# Altium schematic sheet 11.EX-MODULE.SchDoc
size A3
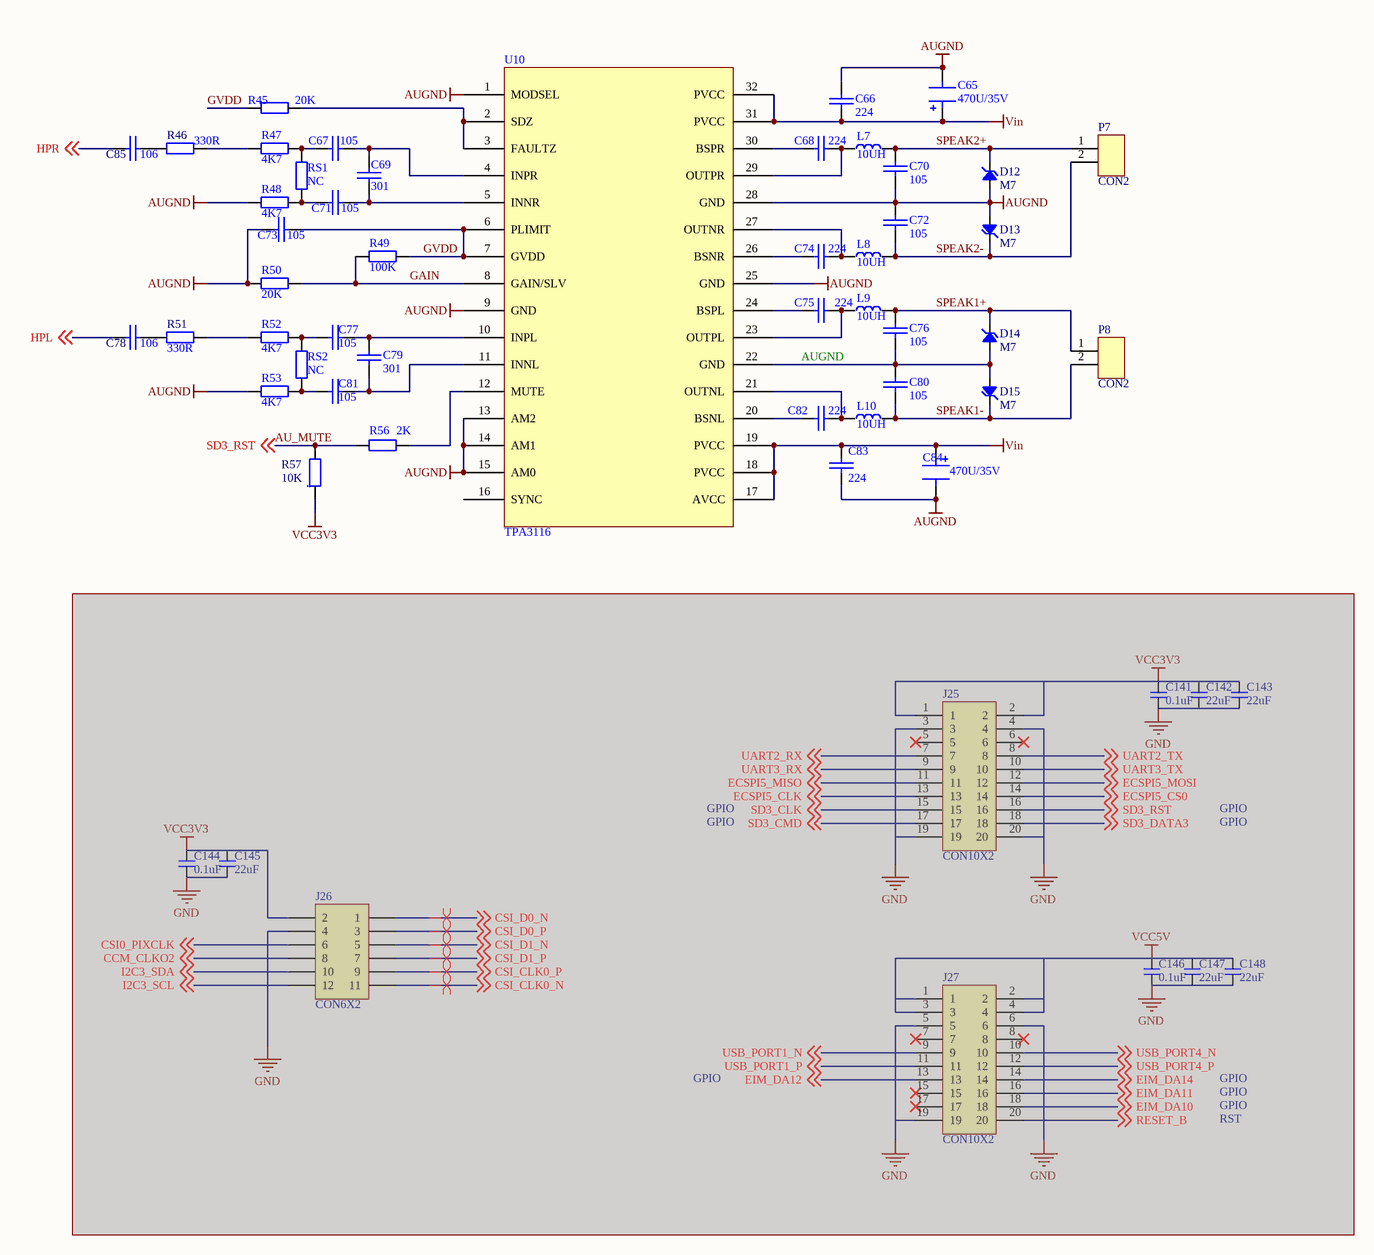
[diagram p0: 11.EX-MODULE.SchDoc]

## Parts
C65  470U/35V  [C8x10-SMD]
C66  224  [0603C]
C67  105  [0603C]
C68  224  [0603C]
C69  301  [0603C]
C70  105  [0603C]
C71  105  [0603C]
C72  105  [0603C]
C73  105  [0603C]
C74  224  [0603C]
C75  224  [0603C]
C76  105  [0603C]
C77  105  [0603C]
C78  106  [0603C]
C79  301  [0603C]
C80  105  [0603C]
C81  105  [0603C]
C82  224  [0603C]
C83  224  [0603C]
C84  470U/35V  [C8x10-SMD]
C85  106  [0603C]
C141  0.1uF  [0603C]  (masked out: inside a compile mask, not in the netlist)
C142  22uF  [0805C]  (masked out: inside a compile mask, not in the netlist)
C143  22uF  [0805C]  (masked out: inside a compile mask, not in the netlist)
C144  0.1uF  [0603C]  (masked out: inside a compile mask, not in the netlist)
C145  22uF  [0805C]  (masked out: inside a compile mask, not in the netlist)
C146  0.1uF  [0603C]  (masked out: inside a compile mask, not in the netlist)
C147  22uF  [0805C]  (masked out: inside a compile mask, not in the netlist)
C148  22uF  [0805C]  (masked out: inside a compile mask, not in the netlist)
D12  M7  [SMA]
D13  M7  [SMA]
D14  M7  [SMA]
D15  M7  [SMA]
J25  CON10X2  [IDC10X2-2.54MM]  (masked out: inside a compile mask, not in the netlist)
J26  CON6X2  [IDC6X2-2.54MM]  (masked out: inside a compile mask, not in the netlist)
J27  CON10X2  [IDC10X2-2.54MM]  (masked out: inside a compile mask, not in the netlist)
L7  10UH  [L-6045]
L8  10UH  [L-6045]
L9  10UH  [L-6045]
L10  10UH  [L-6045]
P7  CON2  [VH3.96-2P-SMT]
P8  CON2  [VH3.96-2P-SMT]
R45  20K  [0603R]
R46  330R  [0603R]
R47  4K7  [0603R]
R48  4K7  [0603R]
R49  100K  [0603R]
R50  20K  [0603R]
R51  330R  [0603R]
R52  4K7  [0603R]
R53  4K7  [0603R]
R56  2K  [0603R]
R57  10K  [0603R]
RS1  NC  [0603R]
RS2  NC  [0603R]
U10  TPA3116  [HTSSOP-32]

## Nets
AUGND: C65.2 C66.2 C70.1 C72.2 C73.1 C76.1 C80.2 C83.2 C84.2 D12.A D13.A D14.A D15.A R48.2 R50.2 R53.2 U10.1(MODSEL) U10.9(GND) U10.13(AM2) U10.14(AM1) U10.15(AM0) U10.22(GND) U10.25(GND) U10.28(GND)
VCC3V3: R57.1
Vin: C65.1 C66.1 C83.1 C84.1 U10.17(AVCC) U10.18(PVCC) U10.19(PVCC) U10.31(PVCC) U10.32(PVCC)
AU_MUTE: R56.1 R57.2 ; off-sheet SD3_RST  [also labelled SD3_RST]
GAIN: R49.1 R50.1 U10.8(GAIN/SLV)
GVDD: C73.2 R45.1 R49.2 U10.6(PLIMIT) U10.7(GVDD)
HPL: C78.1 ; off-sheet HPL
HPR: C85.1 ; off-sheet HPR
SPEAK1+: C76.2 D14.K L9.2 P8.1
SPEAK1-: C80.1 D15.K L10.2 P8.2
SPEAK2+: C70.2 D12.K L7.2 P7.1
SPEAK2-: C72.1 D13.K L8.2 P7.2
NetC67_1: C67.1 R47.1 RS1.1
NetC67_2: C67.2 C69.1 U10.4(INPR)
NetC68_1: C68.1 U10.30(BSPR)
NetC68_2: C68.2 L7.1 U10.29(OUTPR)
NetC69_2: C69.2 C71.2 U10.5(INNR)
NetC71_1: C71.1 R48.1 RS1.2
NetC74_1: C74.1 U10.26(BSNR)
NetC74_2: C74.2 L8.1 U10.27(OUTNR)
NetC75_1: C75.1 U10.24(BSPL)
NetC75_2: C75.2 L9.1 U10.23(OUTPL)
NetC77_1: C77.1 R52.1 RS2.1
NetC77_2: C77.2 C79.1 U10.10(INPL)
NetC78_2: C78.2 R51.1
NetC79_2: C79.2 C81.2 U10.11(INNL)
NetC81_1: C81.1 R53.1 RS2.2
NetC82_1: C82.1 U10.20(BSNL)
NetC82_2: C82.2 L10.1 U10.21(OUTNL)
NetC85_2: C85.2 R46.1
NetR45_2: R45.2 U10.2(SDZ) U10.3(FAULTZ)
NetR46_2: R46.2 R47.2
NetR51_2: R51.2 R52.2
NetR56_2: R56.2 U10.12(MUTE)

Not connected (* = marked no-connect by the designer): U10 16(SYNC)

## Layout directives
differential pair: (no net found under the mark)

## Notes on the sheet
- GPIO
- RST

## Library data of the parts
C65 C84 = ELECTRO
C66-C83 C85 = CAP
C141-C148 = 电容
D12-D15 = SS24: DIODES: *
J26 = Header 6X2: Header, 6-Pin, Dual row; LatestRevisionDate: 17-Jul-2002; LatestRevisionNote: Re-released for DXP Platform.; Publisher: Altium Limited
L7-L10 = INCLUDE
R45-R53 R56 R57 RS1 RS2 = RES
U10 = TPA3116D2